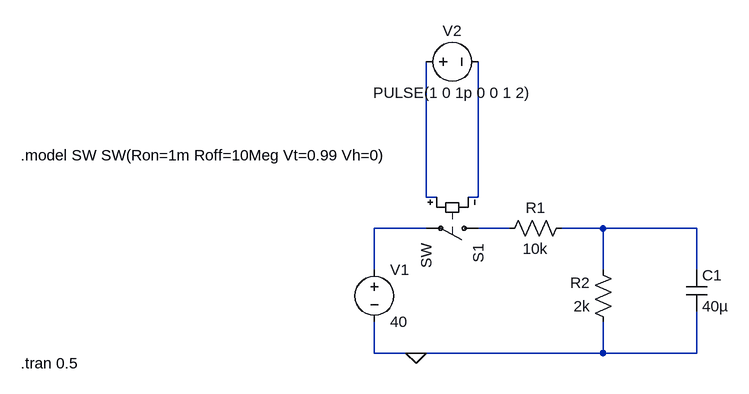
[diagram p0: schematic Q7_6.asc]
Q7_6.asc, the LTspice schematic file:
Version 4
SHEET 1 880 680
WIRE 176 16 176 -192
WIRE 192 16 176 16
WIRE 256 16 256 -192
WIRE 256 16 240 16
WIRE 176 64 96 64
WIRE 304 64 256 64
WIRE 448 64 384 64
WIRE 592 64 448 64
WIRE 96 128 96 64
WIRE 448 128 448 64
WIRE 592 128 592 64
WIRE 96 256 96 208
WIRE 160 256 96 256
WIRE 448 256 448 208
WIRE 448 256 160 256
WIRE 592 256 592 192
WIRE 592 256 448 256
FLAG 160 256 0
SYMBOL voltage 96 112 R0
WINDOW 123 0 0 Left 0
WINDOW 39 0 0 Left 0
SYMATTR InstName V1
SYMATTR Value 40
SYMBOL sw 272 64 R90
SYMATTR InstName S1
SYMBOL res 400 48 R90
WINDOW 0 0 56 VBottom 2
WINDOW 3 32 56 VTop 2
SYMATTR InstName R1
SYMATTR Value 10k
SYMBOL res 464 224 R180
WINDOW 0 36 76 Left 2
WINDOW 3 36 40 Left 2
SYMATTR InstName R2
SYMATTR Value 2k
SYMBOL cap 576 128 R0
SYMATTR InstName C1
SYMATTR Value 40µ
SYMBOL voltage 160 -192 R270
WINDOW 0 32 56 VTop 2
WINDOW 3 -32 56 VBottom 2
WINDOW 123 0 0 Left 0
WINDOW 39 0 0 Left 0
SYMATTR InstName V2
SYMATTR Value PULSE(1 0 1p 0 0 1 2)
TEXT -448 -48 Left 2 !.model SW SW(Ron=1m Roff=10Meg Vt=0.99 Vh=0)
TEXT -448 272 Left 2 !.tran 0.5

The netlist it stands for:
* Q7_6.asc
V1 N003 0 40
S1 N004 N003 N001 N002 SW
R1 N005 N004 10k
R2 0 N005 2k
C1 N005 0 40µ
V2 N001 N002 PULSE(1 0 1p 0 0 1 2)
.model SW SW(Ron=1m Roff=10Meg Vt=0.99 Vh=0)
.tran 0.5
.backanno
.end